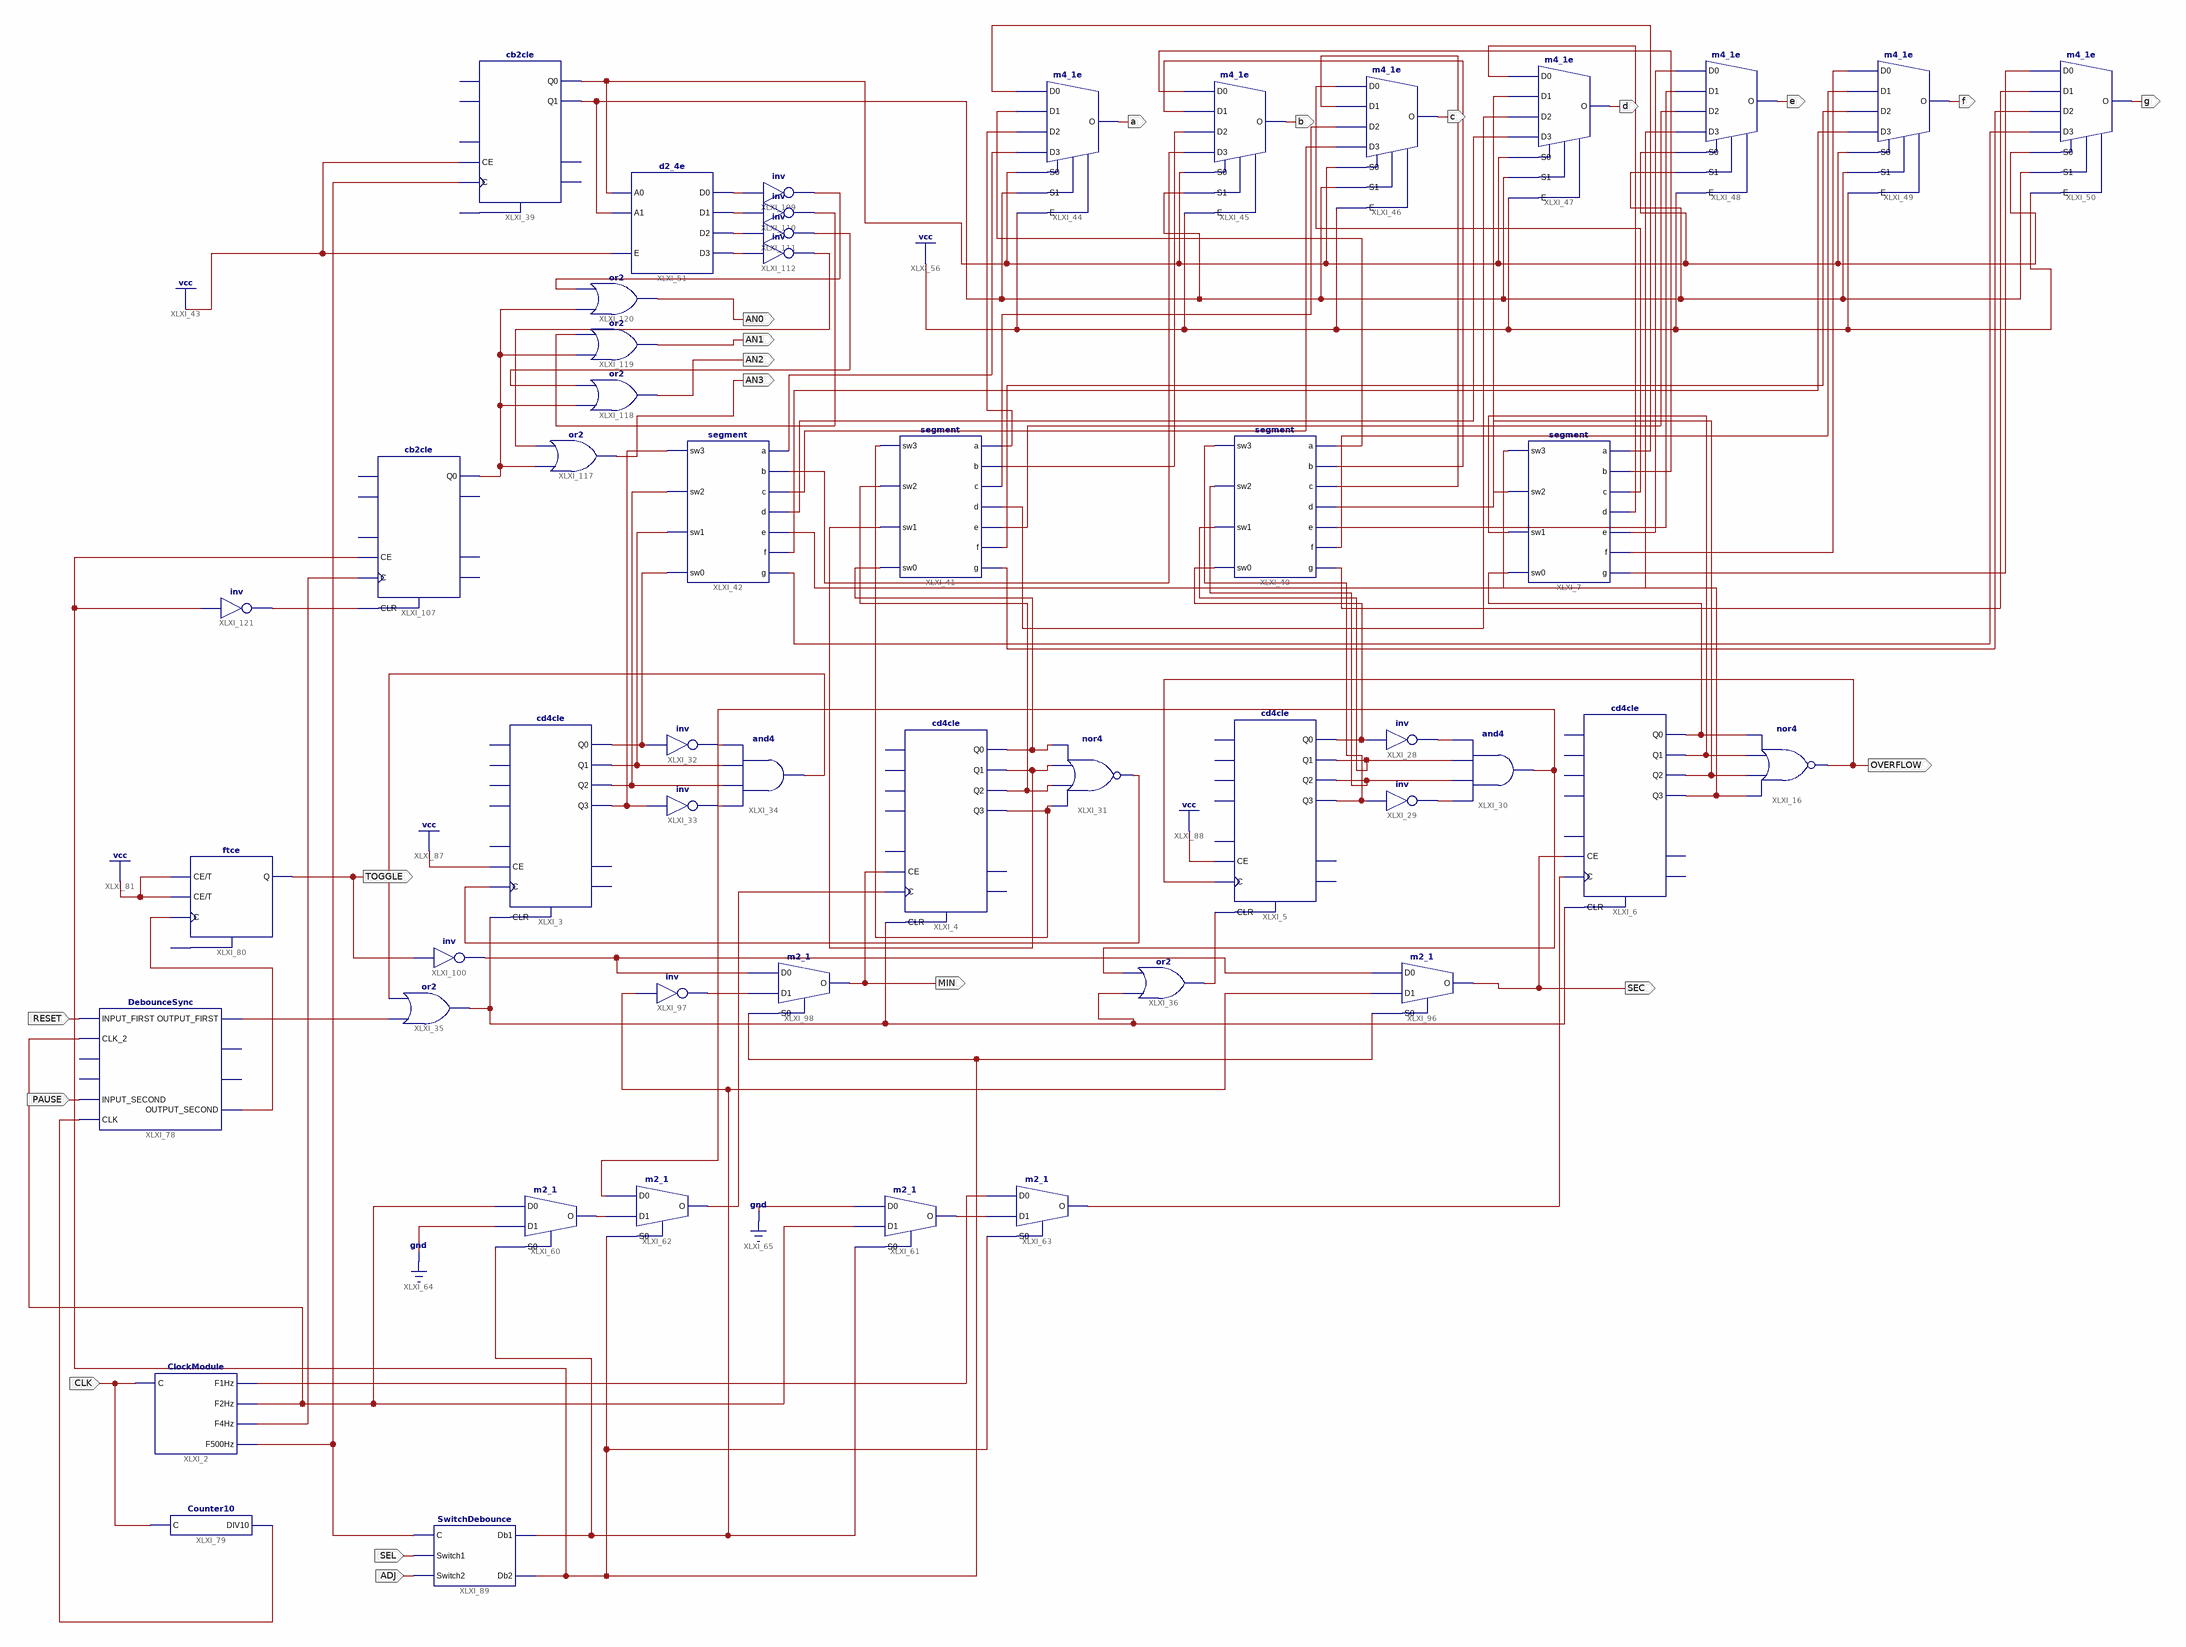
[diagram p0: schematic sheet 1]
// Xilinx ISE schematic stopwatch.sch (spartan6) as structural Verilog: 50 symbols, 20 ports
module stopwatch (
  input  CLK,
  input  SEL,
  input  ADJ,
  input  RESET,
  input  PAUSE,
  output a,
  output b,
  output c,
  output d,
  output e,
  output f,
  output g,
  output MIN,
  output SEC,
  output OVERFLOW,
  output TOGGLE,
  output AN3,
  output AN2,
  output AN1,
  output AN0
);

  wire XLXN_86, XLXN_87, XLXN_91, XLXN_100, XLXN_108, XLXN_109, XLXN_113, XLXN_121, XLXN_124, XLXN_173,
       XLXN_174, XLXN_175, XLXN_176, XLXN_177, XLXN_178, XLXN_179, XLXN_180, XLXN_181, XLXN_182, XLXN_184,
       XLXN_186, XLXN_188, XLXN_189, XLXN_190, XLXN_194, XLXN_195, XLXN_196, XLXN_197, XLXN_198, XLXN_199,
       XLXN_200, XLXN_201, XLXN_202, XLXN_203, XLXN_204, XLXN_205, XLXN_206, XLXN_207, XLXN_208, XLXN_209,
       XLXN_210, XLXN_211, XLXN_212, XLXN_213, XLXN_214, XLXN_215, XLXN_216, XLXN_217, XLXN_218, XLXN_219,
       XLXN_220, XLXN_221, XLXN_256, XLXN_264, XLXN_305, XLXN_313, XLXN_339, XLXN_347, XLXN_355, XLXN_369,
       XLXN_380, XLXN_392, XLXN_393, XLXN_402, XLXN_417, XLXN_434, XLXN_445, XLXN_449, XLXN_461, XLXN_466,
       XLXN_477, XLXN_478, XLXN_479, XLXN_480, XLXN_501, XLXN_503, XLXN_504, XLXN_505, XLXN_506, XLXN_511;

  cd4cle XLXI_4 (
    .C(XLXN_339), .CE(MIN), .CLR(XLXN_121), .Q0(XLXN_181), .Q1(XLXN_182), .Q2(XLXN_184), .Q3(XLXN_91));  // open: D0, D1, D2, D3, L, CEO, TC
  cd4cle XLXI_3 (
    .C(XLXN_100), .CE(1'b1), .CLR(XLXN_121), .Q0(XLXN_186), .Q1(XLXN_188), .Q2(XLXN_189), .Q3(XLXN_190));  // open: D0, D1, D2, D3, L, CEO, TC
  cd4cle XLXI_5 (
    .C(OVERFLOW), .CE(1'b1), .CLR(XLXN_124), .Q0(XLXN_177), .Q1(XLXN_178), .Q2(XLXN_179), .Q3(XLXN_180));  // open: D0, D1, D2, D3, L, CEO, TC
  ClockModule XLXI_2 (.C(CLK), .F1Hz(XLXN_355), .F2Hz(XLXN_393), .F4Hz(XLXN_466), .F500Hz(XLXN_369));
  nor XLXI_16 (OVERFLOW, XLXN_176, XLXN_175, XLXN_174, XLXN_173);
  cd4cle XLXI_6 (
    .C(XLXN_347), .CE(SEC), .CLR(XLXN_121), .Q0(XLXN_173), .Q1(XLXN_174), .Q2(XLXN_175), .Q3(XLXN_176));  // open: D0, D1, D2, D3, L, CEO, TC
  not XLXI_28 (XLXN_87, XLXN_177);
  not XLXI_29 (XLXN_86, XLXN_180);
  and XLXI_30 (XLXN_434, XLXN_86, XLXN_179, XLXN_178, XLXN_87);
  nor XLXI_31 (XLXN_100, XLXN_91, XLXN_184, XLXN_182, XLXN_181);
  not XLXI_32 (XLXN_109, XLXN_186);
  not XLXI_33 (XLXN_108, XLXN_190);
  and XLXI_34 (XLXN_113, XLXN_108, XLXN_189, XLXN_188, XLXN_109);
  or XLXI_35 (XLXN_121, XLXN_402, XLXN_113);
  or XLXI_36 (XLXN_124, XLXN_121, XLXN_434);
  segment XLXI_7 (
    .sw3(XLXN_176), .sw2(XLXN_175), .sw1(XLXN_174), .sw0(XLXN_173), .a(XLXN_197), .b(XLXN_201), .c(XLXN_205),
    .d(XLXN_209), .e(XLXN_213), .f(XLXN_217), .g(XLXN_221));
  cb2cle XLXI_39 (.C(XLXN_369), .CE(1'b1), .Q0(XLXN_256), .Q1(XLXN_264));  // open: CLR, D0, D1, L, CEO, TC
  segment XLXI_40 (
    .sw3(XLXN_180), .sw2(XLXN_179), .sw1(XLXN_178), .sw0(XLXN_177), .a(XLXN_196), .b(XLXN_200), .c(XLXN_204),
    .d(XLXN_208), .e(XLXN_212), .f(XLXN_216), .g(XLXN_220));
  segment XLXI_41 (
    .sw3(XLXN_91), .sw2(XLXN_184), .sw1(XLXN_182), .sw0(XLXN_181), .a(XLXN_195), .b(XLXN_199), .c(XLXN_203),
    .d(XLXN_207), .e(XLXN_211), .f(XLXN_215), .g(XLXN_219));
  segment XLXI_42 (
    .sw3(XLXN_190), .sw2(XLXN_189), .sw1(XLXN_188), .sw0(XLXN_186), .a(XLXN_194), .b(XLXN_198), .c(XLXN_202),
    .d(XLXN_206), .e(XLXN_210), .f(XLXN_214), .g(XLXN_218));
  m4_1e XLXI_44 (
    .D0(XLXN_197), .D1(XLXN_196), .D2(XLXN_195), .D3(XLXN_194), .E(1'b1), .S0(XLXN_256), .S1(XLXN_264), .O(a));
  m4_1e XLXI_45 (
    .D0(XLXN_201), .D1(XLXN_200), .D2(XLXN_199), .D3(XLXN_198), .E(1'b1), .S0(XLXN_256), .S1(XLXN_264), .O(b));
  m4_1e XLXI_46 (
    .D0(XLXN_205), .D1(XLXN_204), .D2(XLXN_203), .D3(XLXN_202), .E(1'b1), .S0(XLXN_256), .S1(XLXN_264), .O(c));
  m4_1e XLXI_47 (
    .D0(XLXN_209), .D1(XLXN_208), .D2(XLXN_207), .D3(XLXN_206), .E(1'b1), .S0(XLXN_256), .S1(XLXN_264), .O(d));
  m4_1e XLXI_48 (
    .D0(XLXN_213), .D1(XLXN_212), .D2(XLXN_211), .D3(XLXN_210), .E(1'b1), .S0(XLXN_256), .S1(XLXN_264), .O(e));
  m4_1e XLXI_49 (
    .D0(XLXN_217), .D1(XLXN_216), .D2(XLXN_215), .D3(XLXN_214), .E(1'b1), .S0(XLXN_256), .S1(XLXN_264), .O(f));
  m4_1e XLXI_50 (
    .D0(XLXN_221), .D1(XLXN_220), .D2(XLXN_219), .D3(XLXN_218), .E(1'b1), .S0(XLXN_256), .S1(XLXN_264), .O(g));
  m2_1 XLXI_60 (.D0(XLXN_393), .D1(1'b0), .S0(XLXN_380), .O(XLXN_305));
  m2_1 XLXI_62 (.D0(XLXN_434), .D1(XLXN_305), .S0(XLXN_461), .O(XLXN_339));
  m2_1 XLXI_63 (.D0(XLXN_355), .D1(XLXN_313), .S0(XLXN_461), .O(XLXN_347));
  m2_1 XLXI_61 (.D0(1'b0), .D1(XLXN_393), .S0(XLXN_380), .O(XLXN_313));
  DebounceSync XLXI_78 (
    .INPUT_FIRST(RESET), .CLK_2(XLXN_393), .INPUT_SECOND(PAUSE), .CLK(XLXN_392), .OUTPUT_FIRST(XLXN_402),
    .OUTPUT_SECOND(XLXN_417));  // open: INPUT_FOURTH, INPUT_THIRD, OUTPUT_FOURTH, OUTPUT_THIRD
  Counter10 XLXI_79 (.C(CLK), .DIV10(XLXN_392));
  SwitchDebounce XLXI_89 (.C(XLXN_369), .Switch1(SEL), .Switch2(ADJ), .Db1(XLXN_380), .Db2(XLXN_461));
  ftce XLXI_80 (.C(XLXN_417), .CE(1'b1), .T(1'b1), .Q(TOGGLE));  // open: CLR
  m2_1 XLXI_96 (.D0(XLXN_449), .D1(XLXN_380), .S0(XLXN_461), .O(SEC));
  not XLXI_97 (XLXN_445, XLXN_380);
  m2_1 XLXI_98 (.D0(XLXN_449), .D1(XLXN_445), .S0(XLXN_461), .O(MIN));
  not XLXI_100 (XLXN_449, TOGGLE);
  d2_4e XLXI_51 (.A0(XLXN_256), .A1(XLXN_264), .E(1'b1), .D0(XLXN_477), .D1(XLXN_478), .D2(XLXN_479), .D3(XLXN_480));
  cb2cle XLXI_107 (.C(XLXN_466), .CE(XLXN_461), .CLR(XLXN_511), .Q0(XLXN_501));  // open: D0, D1, L, CEO, Q1, TC
  not XLXI_109 (XLXN_503, XLXN_477);
  not XLXI_110 (XLXN_504, XLXN_478);
  not XLXI_111 (XLXN_505, XLXN_479);
  not XLXI_112 (XLXN_506, XLXN_480);
  or XLXI_117 (AN3, XLXN_501, XLXN_506);
  or XLXI_118 (AN2, XLXN_501, XLXN_505);
  or XLXI_119 (AN1, XLXN_501, XLXN_504);
  or XLXI_120 (AN0, XLXN_501, XLXN_503);
  not XLXI_121 (XLXN_511, XLXN_461);

  // Notes on the sheet:
  //   LOC on signal CLK = V10
  //   LOC on signal a = T17
  //   LOC on signal b = T18
  //   LOC on signal c = U17
  //   LOC on signal d = U18
  //   LOC on signal e = M14
  //   LOC on signal f = N14
  //   LOC on signal g = L14
  //   LOC on signal SEL = T9
  //   LOC on signal ADJ = T10
  //   LOC on signal RESET = C4
  //   LOC on signal PAUSE = D9
  //   LOC on signal AN3 = P17
  //   LOC on signal AN2 = P18
  //   LOC on signal AN1 = N15
  //   LOC on signal AN0 = N16
endmodule
